# EAGLE design control_board (EAGLE 8.5.2)
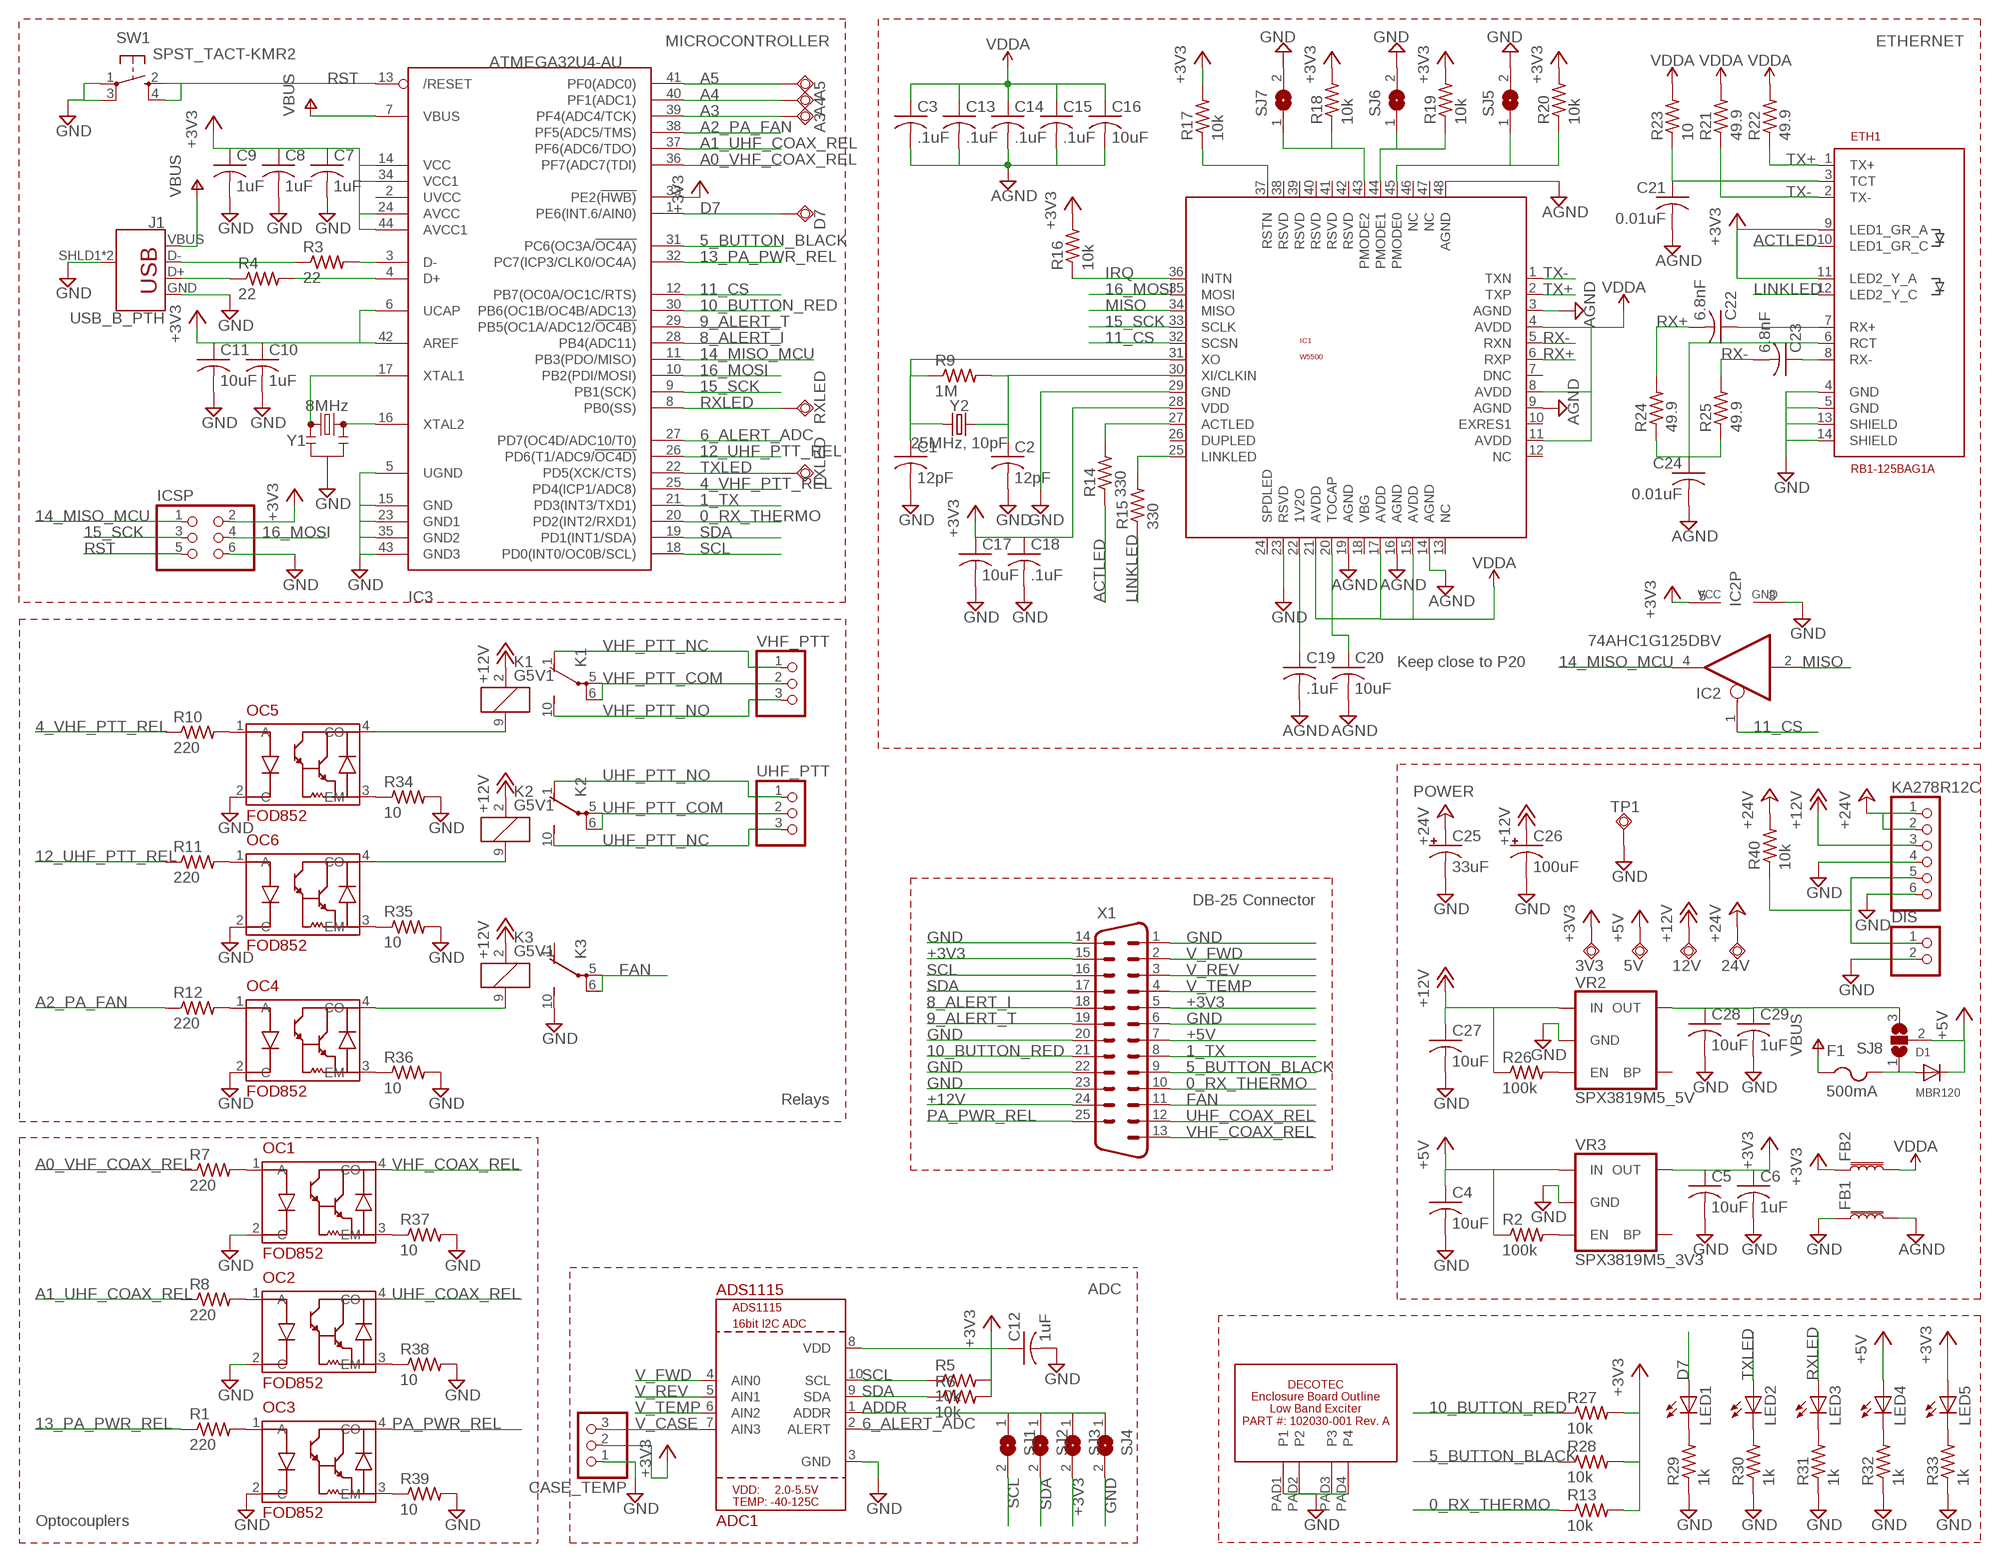
[diagram p0: schematic, sheet 1]

## Parts
3V3  TPSQTP20SQ  [TP20SQ]
5V  TPSQTP20SQ  [TP20SQ]
12V  TPSQTP20SQ  [TP20SQ]
24V  TPSQTP20SQ  [TP20SQ]
A3  TPSQTP20SQ  [TP20SQ]
A4  TPSQTP20SQ  [TP20SQ]
A5  TPSQTP20SQ  [TP20SQ]
ADC1  ADS1115  [MSOP10]
C1  12pF  C-USC0805K  [C0805K]
C2  12pF  C-USC0805K  [C0805K]
C3  .1uF  C-USC0805K  [C0805K]
C4  10uF  C-USC0805K  [C0805K]
C5  10uF  C-USC0805K  [C0805K]
C6  1uF  C-USC0805K  [C0805K]
C7  1uF  C-USC0805K  [C0805K]
C8  1uF  C-USC0805K  [C0805K]
C9  1uF  C-USC0805K  [C0805K]
C10  1uF  C-USC0805K  [C0805K]
C11  10uF  C-USC0805K  [C0805K]
C12  1uF  C-USC0805K  [C0805K]
C13  .1uF  C-USC0805K  [C0805K]
C14  .1uF  C-USC0805K  [C0805K]
C15  .1uF  C-USC0805K  [C0805K]
C16  10uF  C-USC0805K  [C0805K]
C17  10uF  C-USC0805K  [C0805K]
C18  .1uF  C-USC0805K  [C0805K]
C19  .1uF  C-USC0805K  [C0805K]
C20  10uF  C-USC0805K  [C0805K]
C21  0.01uF  C-USC0805K  [C0805K]
C22  6.8nF  C-USC0805K  [C0805K]
C23  6.8nF  C-USC0805K  [C0805K]
C24  0.01uF  C-USC0805K  [C0805K]
C25  33uF  CPOL-USC  [PANASONIC_C]
C26  100uF  CPOL-USD  [PANASONIC_D]
C27  10uF  C-USC0805K  [C0805K]
C28  10uF  C-USC0805K  [C0805K]
C29  1uF  C-USC0805K  [C0805K]
CASE_TEMP  PINHD-1X3  [1X03]
D1  MBR120  DIODESOD-123  [SOD-123]
D7  TPSQTP20SQ  [TP20SQ]
DIS  PINHD-1X2  [1X02]
ETH1  RB1-125BAG1A  [RB1-125BAG1A]
F1  500mA  PTCFUSE-1206  [R1206]
FB1  FERRITE_BEAD  [0805]
FB2  FERRITE_BEAD  [0805]
IC1  W5500  [LQFP48]
IC2  74AHC1G125DBV  [SOT23-5]
IC3  ATMEGA32U4-AU  [TQFP44]
ICSP  PINHD-2X3  [2X03]
J1  USB_B_PTH  [USB-B-PTH]
K1  G5V1  [G5V1]
K2  G5V1  [G5V1]
K3  G5V1  [G5V1]
KA278R12C  PINHD-1X6  [1X06]
LED1  LEDCHIPLED_0805  [CHIPLED_0805]
LED2  LEDCHIPLED_0805  [CHIPLED_0805]
LED3  LEDCHIPLED_0805  [CHIPLED_0805]
LED4  LEDCHIPLED_0805  [CHIPLED_0805]
LED5  LEDCHIPLED_0805  [CHIPLED_0805]
OC1  FOD852  [SMD4-7]
OC2  FOD852  [SMD4-7]
OC3  FOD852  [SMD4-7]
OC4  FOD852  [SMD4-7]
OC5  FOD852  [SMD4-7]
OC6  FOD852  [SMD4-7]
R1  220  R-US_R0805  [R0805]
R2  100k  R-US_R0805  [R0805]
R3  22  R-US_R0805  [R0805]
R4  22  R-US_R0805  [R0805]
R5  10k  R-US_R0805  [R0805]
R6  10k  R-US_R0805  [R0805]
R7  220  R-US_R0805  [R0805]
R8  220  R-US_R0805  [R0805]
R9  1M  R-US_R0805  [R0805]
R10  220  R-US_R0805  [R0805]
R11  220  R-US_R0805  [R0805]
R12  220  R-US_R0805  [R0805]
R13  10k  R-US_R0805  [R0805]
R14  330  R-US_R0805  [R0805]
R15  330  R-US_R0805  [R0805]
R16  10k  R-US_R0805  [R0805]
R17  10k  R-US_R0805  [R0805]
R18  10k  R-US_R0805  [R0805]
R19  10k  R-US_R0805  [R0805]
R20  10k  R-US_R0805  [R0805]
R21  49.9  R-US_R0805  [R0805]
R22  49.9  R-US_R0805  [R0805]
R23  10  R-US_R0805  [R0805]
R24  49.9  R-US_R0805  [R0805]
R25  49.9  R-US_R0805  [R0805]
R26  100k  R-US_R0805  [R0805]
R27  10k  R-US_R0805  [R0805]
R28  10k  R-US_R0805  [R0805]
R29  1k  R-US_R0805  [R0805]
R30  1k  R-US_R0805  [R0805]
R31  1k  R-US_R0805  [R0805]
R32  1k  R-US_R0805  [R0805]
R33  1k  R-US_R0805  [R0805]
R34  10  R-US_R0805  [R0805]
R35  10  R-US_R0805  [R0805]
R36  10  R-US_R0805  [R0805]
R37  10  R-US_R0805  [R0805]
R38  10  R-US_R0805  [R0805]
R39  10  R-US_R0805  [R0805]
R40  10k  R-US_R0805  [R0805]
RXLED  TPSQTP20SQ  [TP20SQ]
SJ1  SJ  [SJ]
SJ2  SJ  [SJ]
SJ3  SJ  [SJ]
SJ4  SJ  [SJ]
SJ5  SJ  [SJ]
SJ6  SJ  [SJ]
SJ7  SJ  [SJ]
SJ8  SJ2W  [SJ_2]
SW1  SPST_TACT-KMR2  [KMR2]
TP1  TPSQTP20SQ  [TP20SQ]
TXLED  TPSQTP20SQ  [TP20SQ]
U$3  DECOTEC_102030-001AV3  [DECOTEC_102030-001A_V3]
UHF_PTT  PINHD-1X3  [1X03]
VHF_PTT  PINHD-1X3  [1X03]
VR2  SPX3819M5_5V  V_REG_SPX3819-SOT23-5  [SOT23-5]
VR3  SPX3819M5_3V3  V_REG_SPX3819-SOT23-5  [SOT23-5]
X1  DB25_MALEVB  [M25VB]
Y1  8MHz  RESONATOR-8MHZSMD_3.2X1.3  [RESONATOR-SMD-3.2X1.3]
Y2  25MHz, 10pF  CRYSTALSMD-3.2X2.5  [CRYSTAL-SMD-3.2X2.5MM]

## Nets
0_RX_THERMO: IC3.20(PD2(INT2/RXD1)) R13.1 X1.10
1_TX: IC3.21(PD3(INT3/TXD1)) X1.8
4_VHF_PTT_REL: IC3.25(PD4(ICP1/ADC8)) R10.1
5_BUTTON_BLACK: IC3.31(PC6(OC3A/!OC4A)) R28.1 X1.9
6_ALERT_ADC: ADC1.2(ALERT) IC3.27(PD7(OC4D/ADC10/T0))
8_ALERT_I: IC3.28(PB4(ADC11)) X1.18
9_ALERT_T: IC3.29(PB5(OC1A/ADC12/!OC4B)) X1.19
10_BUTTON_RED: IC3.30(PB6(OC1B/OC4B/ADC13)) R27.1 X1.21
11_CS: IC1.32(SCSN) IC2.1(OE) IC3.12(PB7(OC0A/OC1C/RTS))
12_UHF_PTT_REL: IC3.26(PD6(T1/ADC9/!OC4D)) R11.1
13_PA_PWR_REL: IC3.32(PC7(ICP3/CLK0/OC4A)) R1.1
14_MISO_MCU: IC2.4(O) IC3.11(PB3(PDO/MISO)) ICSP.1
15_SCK: IC1.33(SCLK) IC3.9(PB1(SCK)) ICSP.3
16_MOSI: IC1.35(MOSI) IC3.10(PB2(PDI/MOSI)) ICSP.4
+3V3: 3V3.TP ADC1.8(VDD) C5.1 C6.1 C7.1 C8.1 C9.1 C10.1 C11.1 C12.1 C17.1 C18.1 CASE_TEMP.2 ETH1.9(LED1_GR_A) ETH1.11(LED2_Y_A) FB2.1 IC1.28(VDD) IC2.5(VCC) IC3.6(UCAP) IC3.14(VCC) IC3.24(AVCC) IC3.33(PE2(!HWB)) IC3.34(VCC1) IC3.42(AREF) IC3.44(AVCC1) ICSP.2 LED5.A R5.2 R6.2 R13.2 R16.2 R17.2 R18.2 R19.2 R20.2 R27.2 R28.2 SJ3.2 VR3.5(OUT) X1.5 X1.15
+5V: 5V.TP C4.1 D1.C LED4.A R2.1 SJ8.2 VR3.1(IN) X1.7
+12V: 12V.TP C26.+ C27.1 K1.2 K2.2 K3.2 KA278R12C.3 R26.1 VR2.1(IN) X1.24
+24V: 24V.TP C25.+ KA278R12C.1 KA278R12C.2 R40.2
A0_VHF_COAX_REL: IC3.36(PF7(ADC7(TDI)) R7.1
A1_UHF_COAX_REL: IC3.37(PF6(ADC6/TDO)) R8.1
A2_PA_FAN: IC3.38(PF5(ADC5/TMS)) R12.1
A3: A3.TP IC3.39(PF4(ADC4/TCK))
A4: A4.TP IC3.40(PF1(ADC1))
A5: A5.TP IC3.41(PF0(ADC0))
ACTLED: ETH1.10(LED1_GR_C) R14.1
ADDR: ADC1.1(ADDR) SJ1.1 SJ2.1 SJ3.1 SJ4.1
AGND: C3.2 C13.2 C14.2 C15.2 C16.2 C19.2 C20.2 C21.2 C24.2 FB1.2 IC1.3(AGND) IC1.9(AGND) IC1.14(AGND) IC1.16(AGND) IC1.19(AGND) IC1.48(AGND)
D7: D7.TP IC3.1(PE6(INT.6/AIN0)) LED1.A
FAN: K3.5(2:P) K3.6(2:P) X1.11
GND: ADC1.3(GND) C1.2 C2.2 C4.2 C5.2 C6.2 C7.2 C8.2 C9.2 C10.2 C11.2 C12.2 C17.2 C18.2 C25.- C26.- C27.2 C28.2 C29.2 CASE_TEMP.1 DIS.2 ETH1.4(GND) ETH1.5(GND) ETH1.13(SHIELD) ETH1.14(SHIELD) FB1.1 IC1.23(RSVD) IC1.29(GND) IC2.3(GND) IC3.5(UGND) IC3.15(GND) IC3.23(GND1) IC3.35(GND2) IC3.43(GND3) ICSP.6 J1.GND J1.SHLD1(SHIELD) J1.SHLD2(SHIELD) K3.10(2:S) KA278R12C.4 KA278R12C.6 OC1.2(C) OC2.2(C) OC3.2(C) OC4.2(C) OC5.2(C) OC6.2(C) R29.1 R30.1 R31.1 R32.1 R33.1 R34.2 R35.2 R36.2 R37.2 R38.2 R39.2 SJ4.2 SJ5.2 SJ6.2 SJ7.2 SW1.1(P) SW1.3(P1) TP1.TP U$3.PAD1(P1) U$3.PAD2(P2) U$3.PAD3(P3) U$3.PAD4(P4) VR2.2(GND) VR3.2(GND) X1.1 X1.6 X1.14 X1.20 X1.22 X1.23 Y1.2
IRQ: IC1.36(INTN) R16.1
LINKLED: ETH1.12(LED2_Y_C) R15.1
MISO: IC1.34(MISO) IC2.2(I)
N$1: OC3.1(A) R1.2
N$2: K3.9 OC4.4(CO)
N$3: R2.2 VR3.3(EN)
N$4: IC3.17(XTAL1) Y1.1
N$5: IC3.16(XTAL2) Y1.3
N$6: C1.1 IC1.31(XO) R9.1 Y2.1
N$7: C2.1 IC1.30(XI/CLKIN) R9.2 Y2.3
N$8: J1.D- R3.1
N$9: IC3.3(D-) R3.2
N$10: IC3.4(D+) R4.2
N$11: J1.D+ R4.1
N$12: OC1.1(A) R7.2
N$13: OC2.1(A) R8.2
N$14: IC1.37(RSTN) R17.1
N$15: OC5.1(A) R10.2
N$16: LED1.C R29.2
N$17: LED2.C R30.2
N$18: LED4.C R32.2
N$19: LED5.C R33.2
N$20: OC6.1(A) R11.2
N$21: OC4.1(A) R12.2
N$22: K1.9 OC5.4(CO)
N$23: K2.9 OC6.4(CO)
N$24: LED3.C R31.2
N$25: OC5.3(EM) R34.1
N$26: OC6.3(EM) R35.1
N$27: OC4.3(EM) R36.1
N$28: OC1.3(EM) R37.1
N$29: IC1.27(ACTLED) R14.2
N$30: IC1.25(LINKLED) R15.2
N$31: C28.1 C29.1 SJ8.3 VR2.5(OUT)
N$32: OC2.3(EM) R38.1
N$33: C20.1 IC1.20(TOCAP)
N$34: C19.1 IC1.22(1V2O)
N$35: C23.1 ETH1.8(RX-)
N$36: C22.1 ETH1.7(RX+)
N$37: C24.1 ETH1.6(RCT) R24.1 R25.1
N$38: R26.2 VR2.3(EN)
N$39: D1.A F1.2 SJ8.1
N$40: OC3.3(EM) R39.1
N$41: DIS.1 KA278R12C.5 R40.1
PA_PWR_REL: OC3.4(CO) X1.25
PMODE0: IC1.45(PMODE0) R20.1 SJ5.1
PMODE1: IC1.44(PMODE1) R19.1 SJ6.1
PMODE2: IC1.43(PMODE2) R18.1 SJ7.1
RST: IC3.13(/RESET) ICSP.5 SW1.2(S) SW1.4(S1)
RX+: C22.2 IC1.6(RXP) R24.2
RX-: C23.2 IC1.5(RXN) R25.2
RXLED: IC3.8(PB0(SS)) LED3.A RXLED.TP
SCL: ADC1.10(SCL) IC3.18(PD0(INT0/OC0B/SCL)) R5.1 SJ1.2 X1.16
SDA: ADC1.9(SDA) IC3.19(PD1(INT1/SDA)) R6.1 SJ2.2 X1.17
TCT: C21.1 ETH1.3(TCT) R23.1
TX+: ETH1.1(TX+) IC1.2(TXP) R22.1
TX-: ETH1.2(TX-) IC1.1(TXN) R21.1
TXLED: IC3.22(PD5(XCK/CTS)) LED2.A TXLED.TP
UHF_COAX_REL: OC2.4(CO) X1.12
UHF_PTT_COM: K2.5(2:P) K2.6(2:P) UHF_PTT.2
UHF_PTT_NC: K2.10(2:S) UHF_PTT.3
UHF_PTT_NO: K2.1(2:O) UHF_PTT.1
V_CASE: ADC1.7(AIN3) CASE_TEMP.3
V_FWD: ADC1.4(AIN0) X1.2
V_REV: ADC1.5(AIN1) X1.3
V_TEMP: ADC1.6(AIN2) X1.4
VBUS: F1.1 IC3.7(VBUS) J1.VBUS
VDDA: C3.1 C13.1 C14.1 C15.1 C16.1 FB2.2 IC1.4(AVDD) IC1.8(AVDD) IC1.11(AVDD) IC1.15(AVDD) IC1.17(AVDD) IC1.21(AVDD) R21.2 R22.2 R23.2
VHF_COAX_REL: OC1.4(CO) X1.13
VHF_PTT_COM: K1.5(2:P) K1.6(2:P) VHF_PTT.2
VHF_PTT_NC: K1.1(2:O) VHF_PTT.1
VHF_PTT_NO: K1.10(2:S) VHF_PTT.3
Unconnected: IC1.7(DNC) IC1.10(EXRES1) IC1.12(NC) IC1.13(NC) IC1.18(VBG) IC1.24(SPDLED) IC1.26(DUPLED) IC1.38(RSVD) IC1.39(RSVD) IC1.40(RSVD) IC1.41(RSVD) IC1.42(RSVD) IC1.46(NC) IC1.47(NC) IC3.2(UVCC) K3.1(2:O) VR2.4(BP) VR3.4(BP)

## Notes on the sheet
- MICROCONTROLLER | ETHERNET
- Keep close to P20
- POWER
- DB-25 Connector
- Relays
- ADC
- Optocouplers

## Library data of the parts
3V3 5V 12V 24V TP1 = testpad:TPSQ: Test pad
A3-A5 D7 RXLED TXLED = testpad:TPSQ: Test pad; SPICEPREFIX: X
ADC1 = vtgs:ADS1115
C1-C24 C27-C29 = rcl:C-US: CAPACITOR, American symbol; SPICEPREFIX: C
C25 C26 = rcl:CPOL-US: POLARIZED CAPACITOR, American symbol; SPICEPREFIX: C
CASE_TEMP UHF_PTT VHF_PTT = pinhead:PINHD-1X3: PIN HEADER
D1 = adafruit:DIODE: Diode SMADIODE - SMA Surface Mount Package 20V 1A Schottky Diode Digikey: 641-1014-6-ND DO-1N4148 - Through Hole Small Current Diode SOD-123 20V 1 A (.5mV Vf) Schottky Diode - Digikey: MBRX120TPMSCT-ND SOD-323 10V 570mA (.38mV Vf, 3ns) Schottky Diode - Digikey: ZLLS410CT-ND SOD-523 30V 30mA Schottky Diode (RB751S-40TE61) - Digikey: RB751S-40TE61CT-ND SOT23-R/W - SOT23 Package (R = Solder Paste/Reflow Ovens, W = Hand-Soldering) BAT54Film 40V 300mA - Digikey: 497-7162-1-ND
DIS = pinhead:PINHD-1X2: PIN HEADER
ETH1 = vtgs:RB1-125BAG1A
F1 = adafruit:PTCFUSE: PTC fuses, resettable thermistors
FB1 FB2 = vtgs:FERRITE_BEAD
IC1 = vtgs:W5500
IC2 = 74xx-little-us:74*1G125: Single Bus Buffer Gate with 3-State Output
IC3 = adafruit:ATMEGA32U4: http://www.ladyada.net/library/eagle; SPICEPREFIX: X
ICSP = pinhead:PINHD-2X3: PIN HEADER; SPICEPREFIX: X
J1 = SparkFun-Connectors:USB_B: USB Type B Connector SparkFun Products: SparkFun Stepoko <https://www.sparkfun.com/products/13899> PTH; PROD_ID: CONN-08278; SF_ID: PRT-00139; SPICEPREFIX: X
K1-K3 = relay:G5V1: RELAY 1 x switch, 0.5 A/125 V AC, 1 A/24 V DC , Omron; MPN: G5V-1-DC24; OC_FARNELL: 9949593; OC_NEWARK: 36M6377
KA278R12C = pinhead:PINHD-1X6: PIN HEADER
LED1-LED5 = adafruit:LED: LED OSRAM: - CHIPLED LG R971, LG N971, LY N971, LG Q971, LY Q971, LO R971, LY R971 LH N974, LH R974 LS Q976, LO Q976, LY Q976 LO Q996 - Hyper CHIPLED LW Q18S LB Q993, LB Q99A, LB R99A - SideLED LS A670, LO A670, LY A670, LG A670, LP A670 LB A673, LV A673, LT A673, LW A673 LH A674 LY A675 LS A676, LA A676, LO A676, LY A676, LW A676 LS A679, LY A679, LG A679 - Hyper Micro SIDELED® LS Y876, LA Y876, LO Y876, LY Y876 LT Y87S - SmartLED LW L88C, LW L88S LB L89C, LB L89S, LG L890 LS L89K, LO L89K, LY L89K LS L896, LA L896, LO L896, LY L896 - TOPLED LS T670, LO T670, LY T670, LG T670, LP T670 LSG T670, LSP T670, LSY T670, LOP T670, LYG T670 LG T671, LOG T671, LSG T671 LB T673, LV T673, LT T673, LW T673 LH T674 LS T676, LA T676, LO T676, LY T676, LB T676, LH T676, LSB T676, LW T676 LB T67C, LV T67C, LT T67C, LS T67K, LO T67K, LY T67K, LW E67C LS E67B, LA E67B, LO E67B, LY E67B, LB E67C, LV E67C, LT E67C LW T67C LS T679, LY T679, LG T679 LS T770, LO T770, LY T770, LG T770, LP T770 LB T773, LV T773, LT T773, LW T773 LH T774 LS E675, LA E675, LY E675, LS T675 LS T776, LA T776, LO T776, LY T776, LB T776 LHGB T686 LT T68C, LB T68C - Hyper Mini TOPLED® LB M676 - Mini TOPLED Santana® LG M470 LS M47K, LO M47K, LY M47K Source: http://www.osram.convergy.de/
OC1-OC6 = vtgs:FOD852
R1-R40 = rcl:R-US_: RESISTOR, American symbol; SPICEPREFIX: R
SJ1-SJ7 = jumper:SJ: SMD solder JUMPER
SJ8 = jumper:SJ2W: SMD solder JUMPER
SW1 = adafruit:SPST_TACT: SMT 6mm switch, EVQQ2 series http://www.ladyada.net/library/eagle; SPICEPREFIX: S
U$3 = vtgs:DECOTEC_102030-001A
VR2 VR3 = kj4qlp:V_REG_SPX3819: SPX3819 Voltage Regulator 3.3V 500mA, 16V input Datasheet <https://www.exar.com/content/document.ashx?id=22106> SparkFun Products: SparkFun Serial Controlled Motor Driver <https://www.sparkfun.com/products/13911>; PROD_ID: VREG-13321; VALUE: SPX3819M5_X_X
X1 = SparkFun-Retired:DB25_MALE: Various DB25 connectors
Y1 = SparkFun-Clocks:RESONATOR-8MHZ: 8MHz Resonator Digikey Example <http://www.digikey.com/product-detail/en/murata-electronics-north-america/CSTCE10M0G55-R0/490-1196-1-ND/584633> Frequency: 8MHz Frequency Stability: ±0.2% Frequency Tolerance: ±0.5% Capacitance: 33pF SparkFun Products Arduino Pro Mini 328- 3.3V/8MHz <https://www.sparkfun.com/products/11114> SparkFun Digital Sandbox <https://www.sparkfun.com/products/12651>; PROD_ID: XTAL-08895; SPICEPREFIX: J
Y2 = SparkFun-Clocks:CRYSTAL: Crystals (Generic) These are passive quartz crystals, which can be used as a clock source for a microcontroller. Crystal's are two-terminal devices. They require external "load" capacitors to generate an oscillating signal.

## Board
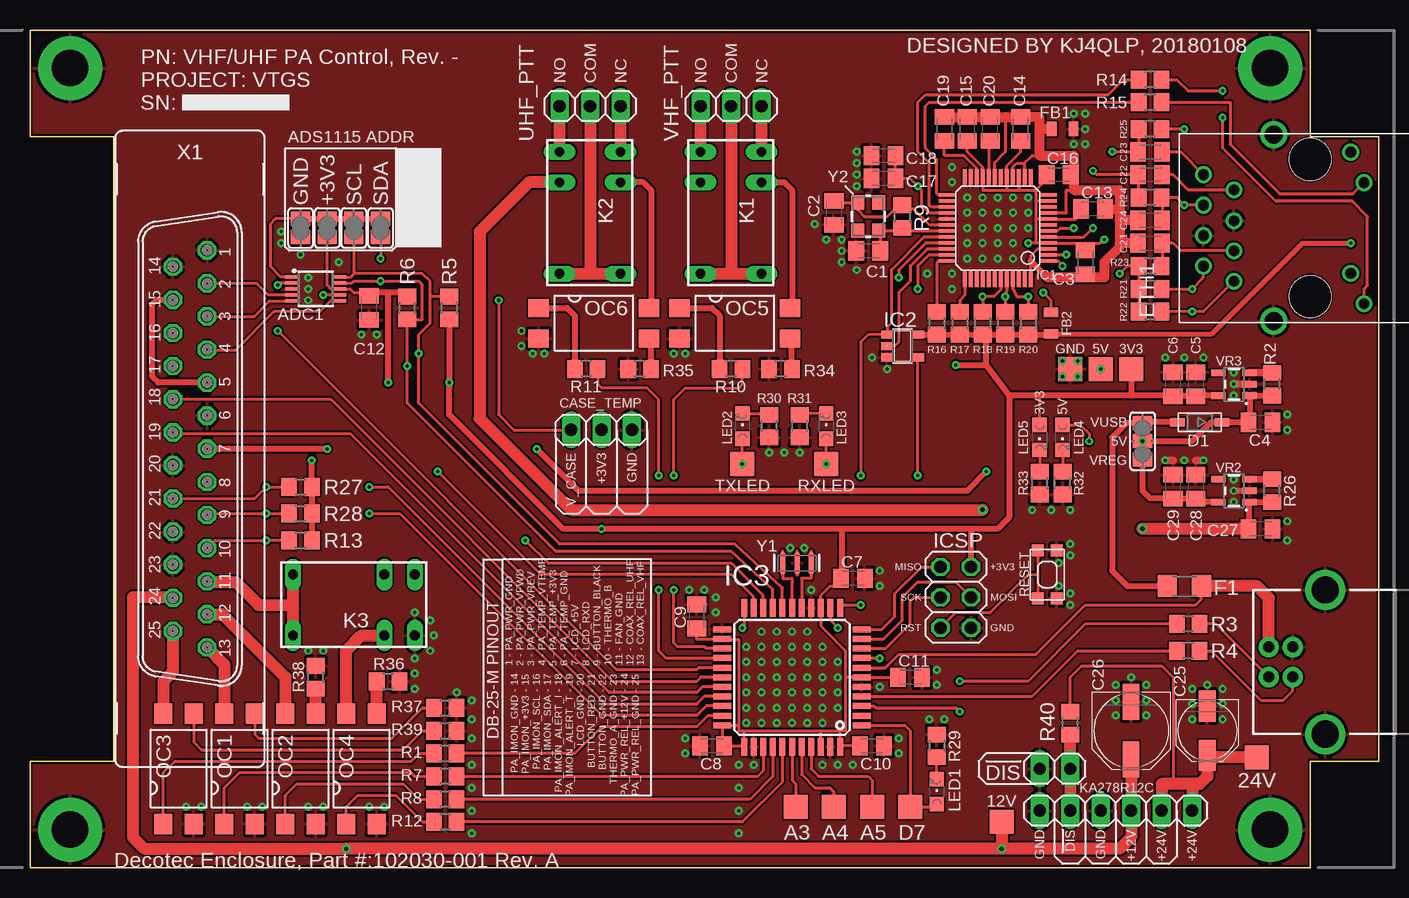
[diagram p1: board, top side]
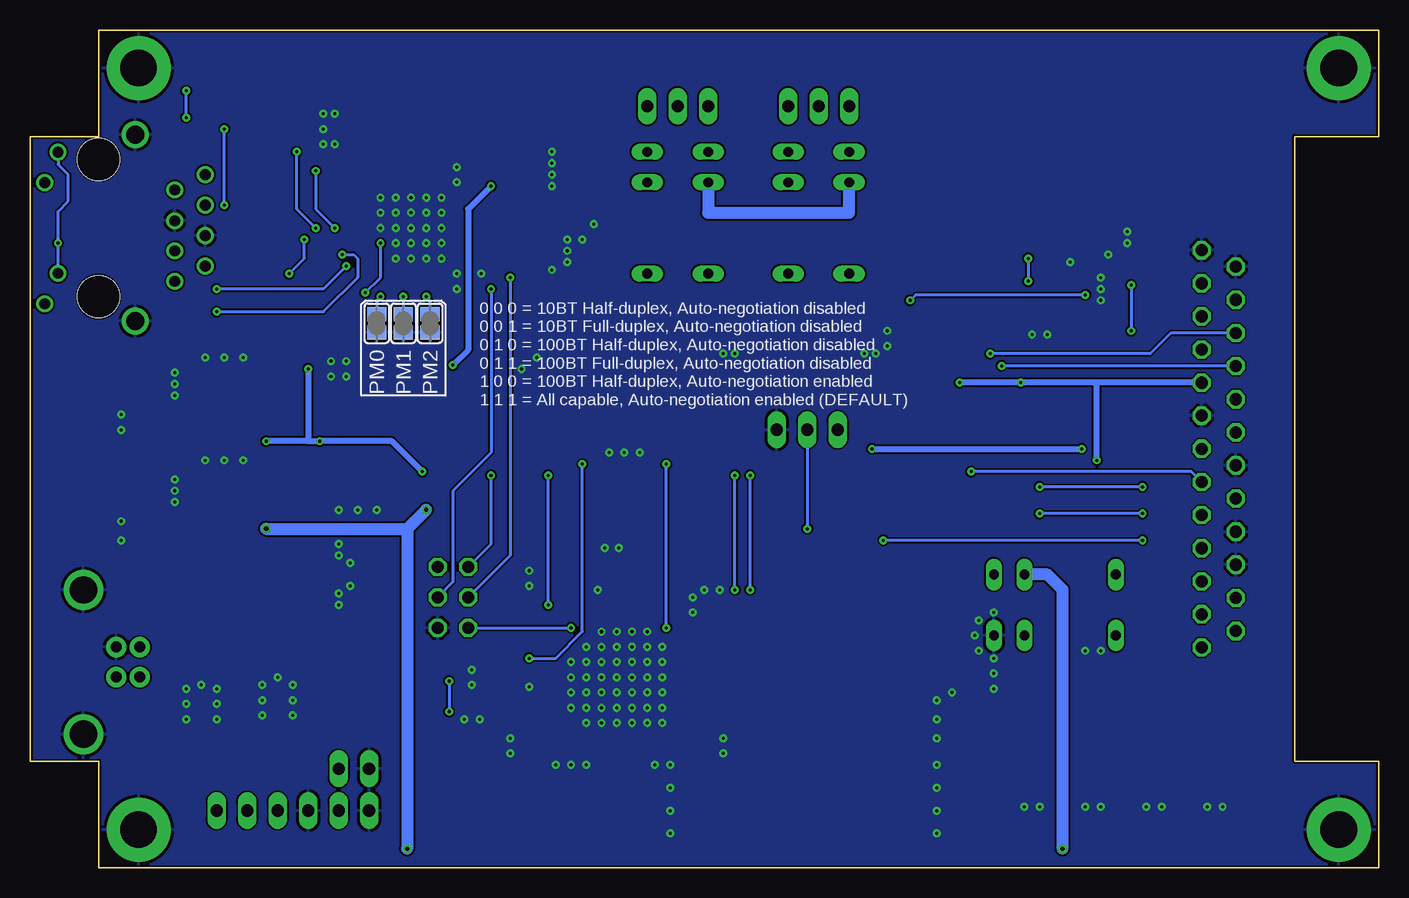
[diagram p2: board, bottom side, seen from below]

Size 112.39 x 69.85 mm. Coordinates in mm from the lower left corner, seen from the top.
Copper layers (1*16): Top 0.035mm / dielectric 1.5mm / Bottom 0.035mm
Design rules "default *": minimum track width 6mil, minimum drill 10mil, track to track 6mil, track to pad 6mil, pad to pad 6mil, via to via 6mil, smd to smd 6mil, copper to edge 6mil, drill to drill 6mil, minimum pad ring 10mil, minimum via ring 8mil, stop-mask expansion 4mil, vias tented up to drill 0mil, thermal gap 10mil

### Footprints (pad centres in the part's own frame; a part is rotated, then mirrored left to right if it is on the bottom)
TP20SQ = smd 2 x 2: TP 0,0
MSOP10 = smd 0.3 x 1: 1 -1,-2.05; 2 -0.5,-2.05; 3 0,-2.05; 4 0.5,-2.05; 5 1,-2.05; 6 1,2.05; 7 0.5,2.05; 8 0,2.05; 9 -0.5,2.05; 10 -1,2.05
C0805K = smd 1.3 x 1.6: 1 -1,0; 2 1,0
PANASONIC_C = smd 2.6 x 1.4: + 2.05,0; - -2.05,0
PANASONIC_D = smd 3 x 1.4: + 2.4,0; - -2.4,0
1X03 = drill 1.016 long: 1 -2.54,0; 2 0,0; 3 2.54,0
SOD-123 = smd 1.2 x 0.7: A 1.85,0; C -1.85,0
1X02 = drill 1.016 long: 1 -1.27,0; 2 1.27,0
RB1-125BAG1A = drill 0.9: 1 -4.445,6.35; 2 -3.175,8.89; 3 -1.905,6.35; 4 -0.635,8.89; 5 0.595,6.35; 6 1.905,8.89; 7 3.175,6.35; 8 4.45,8.89; 9 -3.785,-3.38; 10 -6.325,-4.49; 11 6.325,-3.38; 12 3.785,-4.49 | drill 1.5: 13 -7.775,3.05; 14 7.775,3.05 | hole 3.5: -5.715,0; 5.715,0
R1206 = smd 1.6 x 1.803: 1 -1.422,0; 2 1.422,0
0805 = smd 0.8 x 1.2: 1 -0.9,0; 2 0.9,0
LQFP48 = smd 1.35 x 0.3: 1 -4.25,2.75; 2 -4.25,2.25; 3 -4.25,1.75; 4 -4.25,1.25; 5 -4.25,0.75; 6 -4.25,0.25; 7 -4.25,-0.25; 8 -4.25,-0.75; 9 -4.25,-1.25; 10 -4.25,-1.75; 11 -4.25,-2.25; 12 -4.25,-2.75; 25 4.25,-2.75; 26 4.25,-2.25; 27 4.25,-1.75; 28 4.25,-1.25; 29 4.25,-0.75; 30 4.25,-0.25; 31 4.25,0.25; 32 4.25,0.75; 33 4.25,1.25; 34 4.25,1.75; 35 4.25,2.25; 36 4.25,2.75 | smd 0.3 x 1.35: 13 -2.75,-4.25; 14 -2.25,-4.25; 15 -1.75,-4.25; 16 -1.25,-4.25; 17 -0.75,-4.25; 18 -0.25,-4.25; 19 0.25,-4.25; 20 0.75,-4.25; 21 1.25,-4.25; 22 1.75,-4.25; 23 2.25,-4.25; 24 2.75,-4.25; 37 2.75,4.25; 38 2.25,4.25; 39 1.75,4.25; 40 1.25,4.25; 41 0.75,4.25; 42 0.25,4.25; 43 -0.25,4.25; 44 -0.75,4.25; 45 -1.25,4.25; 46 -1.75,4.25; 47 -2.25,4.25; 48 -2.75,4.25
SOT23-5 = smd 0.69 x 0.99: 1 -0.95,-1.29; 2 0,-1.29; 3 0.95,-1.29; 4 0.95,1.3; 5 -0.95,1.3
TQFP44 = smd 1.5 x 0.5: 1 -5.8,4; 2 -5.8,3.2; 3 -5.8,2.4; 4 -5.8,1.6; 5 -5.8,0.8; 6 -5.8,0; 7 -5.8,-0.8; 8 -5.8,-1.6; 9 -5.8,-2.4; 10 -5.8,-3.2; 11 -5.8,-4; 23 5.8,-4; 24 5.8,-3.2; 25 5.8,-2.4; 26 5.8,-1.6; 27 5.8,-0.8; 28 5.8,0; 29 5.8,0.8; 30 5.8,1.6; 31 5.8,2.4; 32 5.8,3.2; 33 5.8,4 | smd 0.5 x 1.5: 12 -4,-5.8; 13 -3.2,-5.8; 14 -2.4,-5.8; 15 -1.6,-5.8; 16 -0.8,-5.8; 17 0,-5.8; 18 0.8,-5.8; 19 1.6,-5.8; 20 2.4,-5.8; 21 3.2,-5.8; 22 4,-5.8; 34 4,5.8; 35 3.2,5.8; 36 2.4,5.8; 37 1.6,5.8; 38 0.8,5.8; 39 0,5.8; 40 -0.8,5.8; 41 -1.6,5.8; 42 -2.4,5.8; 43 -3.2,5.8; 44 -4,5.8
2X03 = drill 1.016 octagon: 1 -2.54,-1.27; 2 -2.54,1.27; 3 0,-1.27; 4 0,1.27; 5 2.54,-1.27; 6 2.54,1.27
USB-B-PTH = drill 0.914 pad 1.676: D+ 4,1.25; D- 5.981,1.25; GND 4,-1.25; VBUS 5.981,-1.25 | drill 2.286: SHLD1 1.282,-6.02; SHLD2 1.282,6.02
G5V1 = drill 0.813 long: 1 -5.08,-2.54; 2 -2.54,-2.54; 5 5.08,-2.54; 6 5.08,2.54; 9 -2.54,2.54; 10 -5.08,2.54
1X06 = drill 1.016 long: 1 -6.35,0; 2 -3.81,0; 3 -1.27,0; 4 1.27,0; 5 3.81,0; 6 6.35,0
CHIPLED_0805 = smd 1.2 x 1.2: A 0,-1.05; C 0,1.05
SMD4-7 = smd 1.7 x 1.5: 1 -4.6,1.27; 2 -4.6,-1.27; 3 4.6,-1.27; 4 4.6,1.27
R0805 = smd 1.3 x 1.5: 1 -0.95,0; 2 0.95,0
SJ = smd 1.168 x 1.6: 1 -0.762,0; 2 0.762,0
SJ_2 = smd 1.168 x 1.6: 1 -1.524,0; 2 0,0; 3 1.524,0
KMR2 = smd 1 x 1: 1 2,0.8; 2 2,-0.8; 3 -2,0.8; 4 -2,-0.8
DECOTEC_102030-001A_V3 = drill 3.048 pad 5.334: PAD1 10.319,3.175; PAD2 10.319,66.675; PAD3 110.331,66.675; PAD4 110.331,3.175
SOT23-5' = smd 0.55 x 1.2: 1 -0.95,-1.3; 2 0,-1.3; 3 0.95,-1.3; 4 0.95,1.3; 5 -0.95,1.3
M25VB = drill 1.016 octagon: 1 16.561,-1.422; 2 13.792,-1.422; 3 11.049,-1.422; 4 8.28,-1.422; 5 5.512,-1.422; 6 2.769,-1.422; 7 0,-1.422; 8 -2.769,-1.422; 9 -5.512,-1.422; 10 -8.28,-1.422; 11 -11.049,-1.422; 12 -13.792,-1.422; 13 -16.561,-1.422; 14 15.189,1.422; 15 12.421,1.422; 16 9.652,1.422; 17 6.909,1.422; 18 4.14,1.422; 19 1.372,1.422; 20 -1.372,1.422; 21 -4.14,1.422; 22 -6.909,1.422; 23 -9.652,1.422; 24 -12.421,1.422; 25 -15.189,1.422
RESONATOR-SMD-3.2X1.3 = smd 0.45 x 1.905: 1 -1.2,0; 2 0,0; 3 1.2,0
CRYSTAL-SMD-3.2X2.5MM = smd 1.2 x 1.1: 1 -1.175,-0.875; 2 1.175,-0.875; 3 1.175,0.875; 4 -1.175,0.875

### Placement (x,y rotation side)
3V3  91.76,41.59 0 top
5V  89.22,41.59 0 top
12V  80.96,3.81 0 top
24V  102.23,9.21 270 top
A3  63.82,5.08 0 top
A4  66.99,5.08 0 top
A5  70.17,5.08 0 top
ADC1  23.81,48.26 270 top
C1  69.85,51.44 180 top
C2  66.99,54.61 270 top
C3  87.95,50.48 270 top
C4  102.55,37.15 0 top
C5  97.16,40.32 90 top
C6  95.25,40.32 90 top
C7  68.58,24.13 0 top
C8  56.83,10.16 180 top
C9  55.56,20.95 90 top
C10  70.17,10.16 0 top
C11  73.34,15.88 0 top
C12  28.26,46.67 270 top
C13  88.58,54.93 0 top
C14  82.55,61.59 90 top
C15  78.11,61.59 90 top
C16  85.72,57.78 0 top
C17  71.12,57.47 180 top
C18  71.12,59.37 180 top
C19  76.2,61.59 90 top
C20  80.01,61.59 90 top
C21  93.34,52.07 180 top
C22  93.34,57.78 180 top
C23  93.34,59.69 180 top
C24  93.34,53.98 180 top
C25  98.11,11.43 270 top
C26  91.76,11.43 270 top
C27  102.55,28.26 0 top
C28  97.16,31.75 90 top
C29  95.25,31.75 90 top
CASE_TEMP  47.62,36.51 180 top
D1  97.47,37.15 180 top
D7  73.34,5.08 0 top
DIS  85.41,8.26 180 top
ETH1  106.68,53.34 90 top
F1  96.2,23.5 180 top
FB1  86.04,61.59 180 top
FB2  85.09,45.4 90 top
IC1  80.64,53.34 180 top
IC2  72.71,43.5 270 top
IC3  63.5,15.88 180 top
ICSP  77.15,22.54 270 top
J1  109.22,17.14 180 top
K1  58.42,54.61 270 top
K2  46.67,54.61 270 top
K3  26.99,21.91 180 top
KA278R12C  90.49,4.76 180 top
LED1  75.56,6.35 0 top
LED2  59.37,36.83 0 top
LED3  66.36,36.83 0 top
LED4  86.04,35.88 180 top
LED5  84.14,35.88 180 top
OC1  17.46,8.26 90 top
OC2  22.54,8.26 90 top
OC3  12.38,8.26 90 top
OC4  27.62,8.26 90 top
OC5  58.74,45.4 0 top
OC6  46.99,45.4 0 top
R1  34.61,9.53 180 top
R2  103.5,40.32 90 top
R3  96.52,20.32 180 top
R4  96.52,18.1 180 top
R5  34.92,46.67 270 top
R6  31.43,46.67 90 top
R7  34.61,7.62 180 top
R8  34.61,5.71 180 top
R9  72.71,54.29 90 top
R10  58.42,41.59 180 top
R11  46.35,41.59 180 top
R12  34.61,3.81 180 top
R13  22.54,27.3 0 top
R14  93.34,65.72 180 top
R15  93.34,63.82 180 top
R16  75.56,45.4 270 top
R17  77.47,45.4 270 top
R18  79.38,45.4 270 top
R19  81.28,45.4 270 top
R20  83.19,45.4 270 top
R21  93.34,48.26 180 top
R22  93.34,46.35 180 top
R23  93.34,50.16 180 top
R24  93.34,55.88 180 top
R25  93.34,61.59 180 top
R26  103.5,31.43 90 top
R27  22.54,31.75 0 top
R28  22.54,29.53 0 top
R29  75.56,10.16 270 top
R30  61.59,36.83 90 top
R31  64.14,36.83 90 top
R32  86.04,32.07 90 top
R33  84.14,32.07 90 top
R34  62.55,41.59 180 top
R35  50.8,41.59 180 top
R36  29.84,15.56 0 top
R37  34.61,13.34 0 top
R38  23.81,15.88 90 top
R39  34.61,11.43 0 top
R40  86.68,12.06 90 top
RXLED  66.36,33.66 0 top
SJ1  26.99,53.34 270 top
SJ2  29.21,53.34 270 top
SJ3  24.77,53.34 270 top
SJ4  22.54,53.34 270 top
SJ5  83.5,45.4 270 bottom
SJ6  81.28,45.4 270 bottom
SJ7  79.06,45.4 270 bottom
SJ8  92.71,35.56 270 top
SW1  84.77,24.45 270 top
TP1  86.68,41.59 0 top
TXLED  59.37,33.66 0 top
U$3  -6.99,0 0 top
UHF_PTT  46.67,63.5 0 top
VHF_PTT  58.42,63.5 0 top
VR2  SPX3819M5_5V  [SOT23-5']  100.33,31.43 90 top
VR3  SPX3819M5_3V3  [SOT23-5']  100.33,40.32 90 top
X1  13.34,34.92 90 top
Y1  63.92,25.4 0 top
Y2  69.85,54.29 90 top

### Tracks (layer width: path | path; a pad name or v marks a point on that pad's centre or on a via)
0_RX_THERMO  (via drill 0.25)
  Top 0.254: R13.1 v19.68,27.3 15.42,27.3 X1.10 | v41.27,27.3 43.18,25.4 58.42,25.4 61.1,22.72 IC3.20
  Bottom 0.254: v19.68,27.3 v41.27,27.3
1_TX  (via drill 0.25)
  Top 0.254: IC3.21 60.3,22.57 58.42,24.45 42.55,24.45 v33.97,33.02
  Bottom 0.254: X1.8 15.62,33.02 v33.97,33.02
4_VHF_PTT_REL  (via drill 0.25)
  Top 0.254: IC3.25 56.38,18.27 56.2,18.41 53.98,18.41 53.66,18.73 v53.66,23.18 | v53.66,32.7 53.66,39.05 54.61,40.01 59.05,40.01 59.37,40.32 R10.1
  Bottom 0.254: v53.66,23.18 v53.66,32.7
5_BUTTON_BLACK  (via drill 0.25)
  Top 0.254: IC3.31 56.34,13.47 55.56,12.7 47.62,12.7 30.8,29.53 v28.26,29.53 | R28.1 v19.68,29.53 14.87,29.53 X1.9
  Bottom 0.254: v19.68,29.53 v28.26,29.53
6_ALERT_ADC  (via drill 0.25)
  Top 0.254: ADC1.2 20.77,48.76 v20.64,48.58 | IC3.27 55.73,16.68 55.56,16.51 48.9,16.51 v20.64,44.77
  Bottom 0.254: v20.64,48.58 v20.64,44.77
8_ALERT_I
  Top 0.254: X1.18 25.07,39.06 48.58,15.56 55.56,15.56 55.88,15.88 IC3.28
9_ALERT_T
  Top 0.254: X1.19 12.01,36.2 26.67,36.2 48.26,14.61 55.56,14.61 56.03,15.07 IC3.29
10_BUTTON_RED  (via drill 0.25)
  Top 0.254: IC3.30 56.19,14.28 55.56,13.65 47.94,13.65 29.84,31.75 v28.26,31.75 | R27.1 v19.68,31.75 18.72,30.79 X1.21
  Bottom 0.254: v19.68,31.75 v28.26,31.75
11_CS  (via drill 0.25)
  Top 0.254: IC3.12 67.73,21.91 v69.22,21.91 | v69.22,32.7 69.22,43.81 69.85,44.45 IC2.1 71.44,44.45 71.44,45.09 71.75,45.4 71.75,49.85 74.5,52.59 IC1.32
  Bottom 0.254: v69.22,21.91 v69.22,32.7
12_UHF_PTT_REL  (via drill 0.25)
  Top 0.254: IC3.26 57.69,17.46 53.02,17.46 52.39,18.1 v52.39,23.18 | v52.39,32.7 52.39,39.05 51.44,40.01 47.62,40.01 47.31,40.32 R11.1
  Bottom 0.254: v52.39,23.18 v52.39,32.7
13_PA_PWR_REL
  Top 0.254: IC3.32 56.49,12.68 55.56,11.75 47.62,11.75 45.4,9.53 R1.1
14_MISO_MCU  (via drill 0.25)
  Top 0.254: ICSP.1 74.3,25.08 72.07,22.86 72.07,20.95 70.99,19.88 IC3.11 | v73.98,32.7 73.98,42.2 IC2.4
  Bottom 0.254: ICSP.1 73.98,26.99 v73.98,32.7
15_SCK  (via drill 0.25)
  Top 0.254: IC1.33 74.63,52.09 72.39,49.85 v72.39,49.21 | IC3.9 71.3,18.27 73.34,20.32 73.34,22.23 73.66,22.54 ICSP.3
  Bottom 0.254: v72.39,49.21 72.39,26.04 ICSP.3
16_MOSI  (via drill 0.25)
  Top 0.254: IC1.35 74.9,51.09 73.98,50.16 v73.98,48.26 | IC3.10 71.14,19.07 72.71,20.64 72.71,22.54 73.98,23.81 77.15,23.81 ICSP.4
  Bottom 0.254: v73.98,48.26 73.98,34.61 77.15,31.43 77.15,23.81 ICSP.4
+3V3  (via drill 0.25)
  Top 0.254: 76.42,54.61 IC1.28 74.95,54.59 74.3,55.24 74.3,56.52 v73.98,56.83 73.34,57.47 C17.1 C18.1 | IC2.5 73.98,44.42 | C11.1 IC3.6 67.94,15.88 | IC3.44 67.5,10.16 | 67.5,10.16 67.5,11.43 | IC3.42 65.9,11.43 | 65.9,11.43 67.5,11.43 | 67.5,11.43 67.94,11.43 67.94,15.88 | 67.94,15.88 67.94,18.1 66.36,19.68 65.9,20.18 IC3.14 65.9,22.72 66.67,23.5 67.58,23.5 C7.1 | IC3.34 59.37,10.21 | IC3.33 57.78,11.79 | C9.1 55.56,19.05 57.67,19.05 IC3.24 57.73,19.05 59.05,19.05 59.05,11.75 | C12.1 28.26,47.94 26.99,47.94 26.67,48.26 ADC1.8 25.08,48.26 24.77,48.58 SJ3.2 | IC3.33 57.7,10.29 C8.1 59.41,10.16 IC3.34 | C10.1 67.5,10.16 | 14.92,40.32 14.81,40.44 X1.5 | 59.05,11.75 59.05,11.43 59.37,11.43 | 59.37,11.43 65.9,11.43 | IC3.33 58.93,11.88 59.05,11.75 | IC3.34 59.5,11.3 59.37,11.43 | LED5.A 84.14,39.37
  Top 0.406: FB2.1 98.48,44.5 106.05,52.07 v110.06,52.07
  Top 0.508: 79.69,44.45 R18.2 R17.2 R16.2 IC2.5 | 79.69,44.45 R19.2 R20.2 85.04,44.45 FB2.1 | VR3.5 97.2,39.37 C5.1 C6.1 94.89,39.37 91.76,39.37 | 81.6,39.37 79.69,41.91 | 79.69,41.91 79.69,44.45 | v77.15,41.91 79.69,41.91 | 91.76,39.37 84.14,39.37 81.6,39.37 | 81.6,39.37 81.6,29.21 80.64,28.26 78.42,28.26 | C12.1 28.57,47.94 29.84,47.94 | R13.2 R28.2 R27.2 23.49,33.34 v23.5,33.97 | R6.2 31.43,47.94 29.84,47.94 | v29.84,40.44 29.84,47.94 | X1.5 10.68,40.44 10.16,40.96 10.16,46.99 10.52,47.35 X1.15 | R5.2 v34.92,40.44 | v34.92,40.44 34.92,40.01 | v34.92,40.44 34.92,37.78 44.45,28.26 v47.62,28.26 67.63,28.26 | ICSP.2 78.42,28.26 | 78.42,28.26 67.63,28.26 | 3V3.TP 91.76,39.37 | 67.63,28.26 67.63,24.13 C7.1
  Bottom 0.254: ETH1.11 110.06,58.62 109.22,57.78 109.22,55.56 110.06,54.72 v110.06,52.07 ETH1.9 | CASE_TEMP.2 v47.62,28.26
  Bottom 0.508: v73.98,56.83 75.88,54.93 75.88,43.18 v77.15,41.91 | X1.5 23.5,40.44 | 23.5,40.44 v29.84,40.44 v34.92,40.44 | v23.5,33.97 23.5,40.44
+5V  (via drill 0.25)
  Top 0.254: LED4.A 87.53,36.93 88.27,36.2 v88.27,35.56
  Top 0.508: SJ8.2 96.84,35.56 98.42,37.15 D1.C C4.1 101.63,37.23 VR3.1 R2.1 | v79.69,33.02 78.11,31.43 45.72,31.43 v42.23,34.92 | v24.77,34.92 X1.7
  Bottom 0.508: v79.69,33.02 82.23,35.56 v88.27,35.56 89.22,35.56 | 89.22,35.56 SJ8.2 | v42.23,34.92 v24.77,34.92 | 5V.TP 89.22,35.56
  other vias: 92.71,35.56 89.22,41.59
+12V  (via drill 0.35, 0.38)
  Top 0.508: R26.1 VR2.1 101.55,30.41 C27.1
  Top 1.016: C27.1 v92.71,28.26 | K2.2 41.59,57.15 37.47,53.02 37.47,37.47 45.09,29.84 v79.38,29.84 | X1.24 11.87,22.54 8.57,22.54 8.57,2.54 9.53,1.59 v26.35,1.59 v80.96,1.59 | v80.96,1.59 90.81,1.59 91.76,2.54 KA278R12C.3 C26.+ | 12V.TP v80.96,1.59
  Bottom 1.016: K1.2 55.88,54.61 44.13,54.61 K2.2 | v26.35,1.59 26.35,23.18 27.62,24.45 K3.2 | 80.96,28.26 v80.96,1.59 | v92.71,28.26 80.96,28.26 | 80.96,28.26 v79.38,29.84
+24V
  Top 0.254: R40.2 86.68,15.88 87.63,16.83 94.3,16.83 95.25,15.88 95.25,6.99 94.3,6.99
  Top 1.016: 96.84,6.99 KA278R12C.1 | 96.84,6.99 94.3,6.99 KA278R12C.2 | 96.84,6.99 97.47,6.99 98.11,7.62 C25.+ 98.28,9.21 24V.TP
A0_VHF_COAX_REL
  Top 0.254: IC3.36 61.1,8.08 60.64,7.62 R7.1
A1_UHF_COAX_REL
  Top 0.254: IC3.37 61.9,7.61 60.01,5.71 R8.1
A2_PA_FAN
  Top 0.254: IC3.38 62.7,7.14 59.37,3.81 R12.1
A3
  Top 0.254: IC3.39 63.5,7.3 63.82,6.99 A3.TP
A4
  Top 0.254: IC3.40 64.3,7.77 65.41,6.67 66.67,6.67 66.99,6.35 A4.TP
A5
  Top 0.254: IC3.41 65.1,8.24 65.72,7.62 69.85,7.62 70.17,7.3 A5.TP
ACTLED  (via drill 0.25)
  Top 0.254: ETH1.10 111.17,48.3 111.44,48.58 111.44,54.29 110.17,55.56 103.82,55.56 99.38,60.01 v99.38,62.55 | R14.1 95.57,65.72 96.52,64.77 v99.38,64.77
  Bottom 0.254: v99.38,62.55 v99.38,64.77
ADDR
  Top 0.254: ADC1.1 20.91,49.26 20,50.16 20,53.66 20.45,54.1 SJ4.1
  Top 0.508: SJ4.1 SJ3.1 SJ1.1 SJ2.1
AGND
  Top 0.254: IC1.9 84.92,54.61 86.36,54.61 86.36,56.52 87,56.52 | IC1.3 83.96,51.59 83.39,51.03 83.39,50.59 IC1.48 83.39,49.1 | IC1.19 80.39,58.8 81.28,59.69 81.28,62.59 | IC1.16 81.92,57.61 81.92,58.42 82.23,58.74 82.87,58.74 | IC1.14 82.89,58.74 82.87,58.74 | 84.14,59.37 83.5,59.37 82.87,58.74
  Top 0.508: 84.77,49.21 83.39,50.59
  Top 0.813: C19.2 C15.2 C20.2 81.28,62.59 C14.2 84.09,62.59 84.14,62.55 84.14,61.59 | 87,57.78 87,59.37 84.14,59.37 84.14,61.59 | 87,57.78 87,56.52 90.81,56.52 90.81,54.93 | C16.2 87,57.78 | 90.81,54.93 90.81,53.98 | 90.81,53.98 90.81,52.07 | C13.2 90.81,54.93 | C24.2 90.81,53.98 | C21.2 90.81,52.07 | 90.81,52.07 90.81,51.75 89.53,50.48 89.53,49.21 87.95,49.21 | 87.95,49.21 84.77,49.21 | C3.2 87.95,49.21 | FB1.2 84.14,61.59
D7
  Top 0.254: IC3.1 72.9,11.88 73.34,11.43 D7.TP 75.34,5.08 LED1.A
FAN
  Top 1.016: X1.11 14.82,23.81 17.14,23.81 19.05,21.91 21.91,21.91 | K3.5 21.91,21.91 | 21.91,21.91 K3.6
GND  (via drill 0.25)
  Top 0.508: VR2.2 v100.33,31.43
  Top 0.61: v100.33,40.32 VR3.2 | v94.61,33.97 95.25,33.97 | 97.16,33.97 v97.79,33.97
  other vias: 78.11,54.61 78.11,55.88 87.95,62.87 87.95,61.59 87.95,60.33 87,62.87 87,60.33 67.63,51.44 96.2,33.97 104.78,36.51 104.78,37.78 68.9,57.78 68.9,58.74 70.17,42.55 67.63,52.39 67.63,50.48 65.41,53.66 66.36,52.39 97.79,42.55 94.61,42.55 104.78,28.89 63.35,26.67 64.52,26.67 67.31,8.57 56.2,23.18 54.93,23.18 54.61,10.79 54.61,9.53 72.39,9.53 72.39,10.79 75.56,16.51 75.56,15.24 70.8,24.77 70.8,23.5 70.8,15.07 57.15,22.54 65.09,23.18 59.05,8.57 104.78,27.3 23.18,48.26 20.95,52.07 71.44,41.59 19.37,5.08 32.07,16.19 24.45,5.08 29.53,5.08 57.15,21.27 28.89,44.45 27.62,44.45 20.95,53.02 22.54,51.12 25.72,50.48 68.9,49.85 68.9,56.83 68.9,59.69 100.33,32.38 100.33,30.48 96.2,42.55 32.07,17.46 13.02,5.08 32.07,21.27 33.66,19.37 33.34,18.1 33.34,20.64 14.29,5.08 18.1,5.08 23.18,5.08 28.26,5.08 32.07,14.92 61.59,34.61 64.14,34.61 74.93,12.38 76.2,12.38 62.87,34.61 59.05,4.76 59.05,6.67 36.83,4.76 36.83,6.67 36.83,10.79 36.83,12.38 36.83,13.97 35.56,14.61 23.18,49.21 23.18,47.31 63.5,15.88 60.96,15.88 66.04,15.88 66.04,13.34 63.5,13.34 60.96,13.34 60.96,18.41 63.5,18.41 60.96,17.14 60.96,14.61 63.5,14.61 63.5,17.14 66.04,14.61 64.77,13.34 64.77,14.61 64.77,15.88 64.77,17.14 64.77,18.41 62.23,18.41 62.23,17.14 62.23,15.88 62.23,14.61 62.23,13.34 60.96,19.68 62.23,19.68 63.5,19.68 64.77,19.68 60.96,12.06 62.23,12.06 63.5,12.06 64.77,12.06 66.04,12.06 67.31,15.88 67.31,14.61 67.31,13.34 67.31,17.14 66.04,17.14 66.04,18.41 59.69,18.41 59.69,17.14 59.69,15.88 59.69,14.61 59.69,13.34 59.69,12.06 100.33,41.27 100.33,39.37 36.83,8.57 36.83,2.86 23.18,18.1 24.45,18.1 40.96,44.77 40.96,43.5 41.91,42.86 42.86,42.86 53.66,42.86 54.61,42.86 91.76,15.88 90.49,15.24 93.03,15.24 93.03,13.97 93.03,12.7 90.49,12.7 90.49,13.97 98.11,15.24 96.84,14.92 99.38,14.92 96.84,13.65 96.84,12.38 99.38,13.65 87.31,42.23 86.04,42.23 86.04,40.96 87.31,40.96 85.09,29.84 86.68,29.84 83.5,29.84 99.38,12.38 86.68,26.99 86.68,26.04 60.33,8.57 59.05,2.86 86.68,21.91 86.68,22.86 85.72,23.5 85.72,25.4 76.83,49.53 80.64,53.34 81.92,53.34 83.19,53.34 80.64,52.07 81.92,52.07 80.64,50.8 83.19,54.61 81.92,54.61 83.19,55.88 81.92,55.88 80.64,55.88 80.64,54.61 79.38,55.88 78.11,53.34 78.11,52.07 79.38,54.61 79.38,53.34 79.38,52.07 79.38,50.8 81.92,50.8 76.83,57.15 76.83,58.42 76.83,48.26 78.11,50.8 74.78,49.53 66.04,8.57 68.58,8.57
  pour Bottom: 0.32,0.32 0.32,8.57 7.3,8.57 7.3,61.28 0.32,61.28 0.32,69.53 106.36,69.53 106.36,60.64 112.08,60.64 112.08,9.21 106.36,9.21 106.36,0.32
  pour Top: 0.32,0.32 0.32,8.57 7.3,8.57 7.3,61.28 0.32,61.28 0.32,69.53 106.36,69.53 106.36,60.64 112.08,60.64 112.08,9.21 106.36,9.21 106.36,0.32
IRQ
  Top 0.254: 76.31,50.59 IC1.36 75.67,50.59 75.56,50.48 R16.1
LINKLED
  Top 0.254: R15.1 100.01,63.81 100.01,60.33 104.14,56.2 110.24,56.2 ETH1.12
MISO
  Top 0.254: IC1.34 74.77,51.59 73.34,50.16 73.34,48.9 72.39,47.94 72.39,43.81 72.07,43.5 IC2.2
N$1
  Top 0.254: OC3.1 11.11,7.94 12.06,8.89 31.75,8.89 32.38,9.53 R1.2
N$2
  Top 1.016: OC4.4 26.35,18.1 27.62,19.37 K3.9
N$3
  Top 0.61: VR3.3 R2.2
N$4
  Top 0.254: IC3.17 63.5,23.81 63.5,24.13 62.72,24.13 Y1.1
N$5
  Top 0.254: IC3.16 64.3,24.13 65.12,24.13 Y1.3
N$6
  Top 0.254: IC1.31 72.71,53.09 | 72.71,53.09 70.75,53.09 Y2.1 70.85,52.99 C1.1 | R9.1 72.71,53.09
N$7
  Top 0.254: IC1.30 75,53.59 73.66,54.93 73.02,54.93 R9.2 72.39,55.24 71.44,54.29 69.53,54.29 68.97,54.85 Y2.3 67.14,55.47 C2.1
N$8
  Top 0.254: J1.D- 98.81,20.32 R3.1
N$9  (via drill 0.25)
  Top 0.254: R3.2 87.95,20.32 83.19,15.56 v77.47,15.56 | IC3.3 70.34,13.47 70.48,13.34 77.15,13.34 v77.47,13.02
  Bottom 0.254: v77.47,15.56 v77.47,13.02
N$10
  Top 0.254: IC3.4 70.47,14.28 70.48,14.29 83.5,14.29 87.31,18.1 R4.2
N$11
  Top 0.254: R4.1 98.42,18.1 102.55,13.97 104.46,13.97 105.22,14.73 J1.D+
N$12
  Top 0.254: OC1.1 16.19,6.67 17.46,7.94 31.75,7.94 32.07,7.62 R7.2
N$13
  Top 0.254: OC2.1 21.27,6.03 22.23,6.99 31.11,6.99 32.38,5.71 R8.2
N$14
  Top 0.254: IC1.37 77.89,47.73 77.47,47.31 R17.1
N$15
  Top 0.508: OC5.1 56.83,46.67 57.47,46.03 R10.2
N$16
  Top 0.254: LED1.C R29.2
N$17
  Top 0.254: LED2.C 61.49,37.88 R30.2
N$18
  Top 0.254: LED4.C R32.2
N$19
  Top 0.254: LED5.C R33.2
N$20
  Top 0.508: OC6.1 44.77,46.67 45.41,46.03 R11.2
N$21
  Top 0.254: OC4.1 26.35,5.08 27.3,6.03 30.48,6.03 32.7,3.81 R12.2
N$22
  Top 0.508: K1.9 62.87,57.15 63.5,56.52 63.5,46.84 OC5.4
N$23
  Top 0.508: K2.9 51.12,57.15 51.75,56.52 51.75,46.84 OC6.4
N$24
  Top 0.254: LED3.C 64.23,37.88 R31.2
N$25
  Top 0.508: R34.1 63.5,43.97 OC5.3
N$26
  Top 0.508: R35.1 51.75,43.97 OC6.3
N$27
  Top 1.016: OC4.3 R36.1
N$28
  Top 0.254: OC1.3 18.73,11.11 19.05,10.79 30.16,10.79 32.7,13.34 R37.1
N$29
  Top 0.254: IC1.27 75.08,55.09 74.93,55.24 74.93,58.74 73.98,59.69 73.98,63.82 74.61,64.45 89.85,64.45 91.12,65.72 R14.2
N$30
  Top 0.254: IC1.25 75.67,56.09 75.56,56.2 75.56,59.05 74.61,60.01 74.61,63.5 74.93,63.82 R15.2
N$31
  Top 0.508: VR2.5 97.42,30.48 C28.1 C29.1 95.2,30.8 93.34,30.8 92.71,31.43 SJ8.3
N$32
  Top 1.016: OC2.3 R38.1
N$33
  Top 0.254: C20.1 79.89,60.48 IC1.20
N$34
  Top 0.254: IC1.22 78.89,58.31 77.83,59.37 76.2,59.37 C19.1
N$35
  Top 0.254: C23.1 95.89,59.69 ETH1.8
N$36
  Top 0.254: ETH1.7 96.52,56.52 95.25,57.78 C22.1
N$37  (via drill 0.25)
  Top 0.254: R24.1 94.34,55.83 | 94.34,55.83 C24.1 | ETH1.6 v96.2,55.24 95.57,55.88 94.39,55.88 94.34,55.83 | v96.2,61.59 R25.1
  Bottom 0.254: v96.2,55.24 v96.2,61.59
N$38
  Top 0.61: VR2.3 103.22,32.41 R26.2
N$39
  Top 0.508: D1.A 93.09,37.15 SJ8.1 91.38,37.08 90.17,35.88 90.17,24.77 91.44,23.5 F1.2
N$40
  Top 0.254: OC3.3 13.65,10.48 14.29,9.84 31.11,9.84 32.7,11.43 R39.1
N$41
  Top 1.016: R40.1 DIS.1 KA278R12C.5
PA_PWR_REL
  Top 1.016: X1.25 11.91,16.34 11.11,15.56 OC3.4
PMODE0  (via drill 0.25)
  Top 0.254: IC1.45 81.89,48.28 82.23,47.62 v83.19,47.62 R20.1
  Bottom 0.254: v83.19,47.62 83.5,47.31 SJ5.1
PMODE1  (via drill 0.25)
  Top 0.254: IC1.44 81.39,48.05 81.28,47.94 v81.28,47.62 R19.1
  Bottom 0.254: v81.28,47.62 SJ6.1
PMODE2  (via drill 0.25)
  Top 0.254: IC1.43 80.89,48.19 80.33,47.62 v79.38,47.62 R18.1
  Bottom 0.254: SJ7.1 79.06,47.31 v79.38,47.62
RST  (via drill 0.25)
  Top 0.254: IC3.13 66.7,20.66 v67.31,20 | ICSP.5 77.15,21.27 80.01,21.27 83.19,24.45 83.97,24.45 | SW1.4 83.97,24.45 | 83.97,24.45 SW1.2
  Bottom 0.254: ICSP.5 v67.31,20
RX+  (via drill 0.25)
  Top 0.254: R24.2 92.34,55.93 C22.2 88.9,57.78 v88.58,58.1 | IC1.6 85.61,53.09 85.86,53.34 v87,53.34
  Bottom 0.254: v88.58,58.1 88.58,54.93 v87,53.34
RX-  (via drill 0.25)
  Top 0.254: R25.2 92.39,59.74 C23.2 v90.17,59.69 | IC1.5 87.83,52.59 v88.58,53.34
  Bottom 0.254: v88.58,53.34 90.17,54.93 v90.17,59.69
RXLED  (via drill 0.25)
  Top 0.254: IC3.8 70.79,17.48 v70.8,17.46 | RXLED.TP LED3.A
  Bottom 0.254: v70.8,17.46 68.58,17.46 66.36,19.68 RXLED.TP
  other vias: 66.36,33.66
SCL  (via drill 0.25)
  Top 0.254: IC3.18 62.7,23.34 58.74,26.99 44.13,26.99 32.38,38.73 v32.38,42.86 32.38,44.45 33.34,45.4 33.34,47.62 | 26.99,49.53 32.7,49.53 33.34,48.9 33.34,47.62 | SJ1.2 26.99,49.53 | R5.1 33.34,47.62 | 26.99,49.53 26.72,49.26 ADC1.10
  Bottom 0.254: X1.16 17.34,44.58 19.05,42.86 v32.38,42.86
SDA  (via drill 0.25)
  Top 0.254: IC3.19 61.9,23.19 58.42,26.35 43.81,26.35 31.43,38.74 31.43,41.91 | ADC1.9 26.8,48.76 26.99,48.9 v29.21,48.9 32.38,48.9 32.7,48.58 32.7,45.72 R6.1 31.43,41.91 | SJ2.2 v29.21,50.8 | v31.43,41.83 31.43,41.91
  Bottom 0.254: v29.21,50.8 v29.21,48.9 | X1.17 v31.43,41.83
TCT
  Top 0.254: ETH1.3 95.89,51.44 95.25,52.07 C21.1 94.34,50.22 R23.1
TX+  (via drill 0.25)
  Top 0.254: ETH1.1 97.79,46.35 v96.84,46.35 R22.1 | v86.36,51.12 86.33,51.09 IC1.2
  Bottom 0.254: v86.36,51.12 85.41,51.12 85.09,50.8 85.09,49.21 87.95,46.35 v96.84,46.35
TX-  (via drill 0.25)
  Top 0.254: R21.1 v96.84,48.26 97.79,49.21 ETH1.2 | IC1.1 85.71,50.59 86.04,50.26 v86.04,50.16
  Bottom 0.254: v86.04,50.16 87.95,48.26 v96.84,48.26
TXLED  (via drill 0.25)
  Top 0.254: IC3.22 59.5,20.13 v59.37,20 | TXLED.TP LED2.A
  Bottom 0.254: v59.37,20 TXLED.TP
  other vias: 59.37,33.66
UHF_COAX_REL
  Top 1.016: OC2.4 21.27,15.88 16.02,21.13 X1.12
UHF_PTT_COM
  Top 1.016: K2.5 46.67,49.53 | 46.67,49.53 K2.6 | UHF_PTT.2 46.67,49.53
UHF_PTT_NC
  Top 1.016: K2.10 UHF_PTT.3
UHF_PTT_NO
  Top 1.016: K2.1 UHF_PTT.1
V_CASE  (via drill 0.25)
  Top 0.254: ADC1.7 v24.45,47.76 | v39.05,47.31 39.05,37.78 40.32,36.51 CASE_TEMP.3
  Bottom 0.254: v24.45,47.76 38.6,47.76 v39.05,47.31
V_FWD
  Top 0.254: X1.2 18.91,48.72 19.87,47.76 ADC1.4
V_REV
  Top 0.254: ADC1.5 19.95,47.26 18.67,45.97 X1.3
V_TEMP
  Top 0.254: ADC1.6 25.04,47.26 24.13,46.35 20.32,46.35 17.14,43.18 14.78,43.18 X1.4
VBUS
  Top 0.254: IC3.7 71.28,16.68 72.39,17.78 83.82,17.78 87.95,21.91 97.16,21.91 97.62,22.38 F1.1
  Top 1.016: J1.VBUS 103.24,22.49 102.23,23.5 F1.1
VDDA  (via drill 0.25)
  Top 0.254: 82.39,56.52 83.82,56.52 | 83.82,56.52 83.82,55.59 | 83.82,55.59 83.82,54.09 | 83.82,54.09 83.82,52.07 | 83.82,52.07 v83.19,52.07 | 81.39,56.52 IC1.17 81.39,58.53 82.55,59.69 C14.1 | 81.39,56.52 82.39,56.52 | IC1.15 82.39,56.52 | IC1.11 83.82,55.59 | 83.82,54.09 IC1.8 87.15,54.09 C13.1 | 83.82,52.07 84.89,52.07 IC1.4 87.95,52.09 | C15.1 78.11,59.69 79.38,58.42 79.38,57.61 IC1.21 79.39,56.53 79.42,56.52 81.39,56.52 | 83.82,56.52 84.72,57.42 C16.1 | v90.81,49.53 91.44,50.16 R23.2 R21.2 R22.2 | v89.53,52.39 89.2,52.09 87.95,52.09 | 87.95,52.09 C3.1 | FB2.2 85.09,47.31 v84.45,47.94
  Bottom 0.254: v90.81,49.53 89.53,50.8 v89.53,52.39 | v84.45,47.94 83.19,49.21 v83.19,52.07
VHF_COAX_REL
  Top 1.016: X1.13 16.19,16.93 OC1.4
VHF_PTT_COM
  Top 1.016: K1.5 58.42,49.53 | 58.42,49.53 K1.6 | VHF_PTT.2 58.42,49.53
VHF_PTT_NC
  Top 1.016: K1.1 VHF_PTT.1
VHF_PTT_NO
  Top 1.016: K1.10 VHF_PTT.3

### Text on the board
tPlace: DESIGNED BY KJ4QLP, 20180108 | PN: VHF/UHF PA Control, Rev. - | PROJECT: VTGS | SN: | ADS1115 ADDR | GND | +3V3 | SCL | SDA | GND | 3V3 | 5V | VUSB | 5V | V_CASE | +3V3 | GND | VREG | RESET | MISO | +3V3 | SCK | MOSI | RST | GND | DB-25-M PINOUT | 1 - PA_PWR_GND / 2 - PA_PWR_VFWD / 3 - PA_PWR_VREV / 4 - PA_TEMP_VTEMP / 5 - PA_TEMP_+3V3 / 6 - PA_TEMP_GND / 7 - LCD_+5V / 8 - LCD_RXD / 9 - BUTTON_BLACK / 10 - THERMO_B / 11 - FAN_GND / 12 - COAX_REL_UHF / 13 - COAX_REL_VHF | PA_IMON_GND - 14 / PA_IMON_+3V3 - 15 / PA_IMON_SCL - 16 / PA_IMON_SDA - 17 / PA_IMON_ALERT_I - 18 / PA_IMON_ALERT_T - 19 / LCD_GND - 20 / BUTTON_RED - 21 / BUTTON_GND - 22 / THERMO_A_GND - 23 / PA_PWR_REL_+12V - 24 / PA_PWR_REL_GND - 25 | GND | DIS | GND | +12V | +24V | +24V
bPlace: 0 0 0 = 10BT Half-duplex, Auto-negotiation disabled / 0 0 1 = 10BT Full-duplex, Auto-negotiation disabled / 0 1 0 = 100BT Half-duplex, Auto-negotiation disabled / 0 1 1 = 100BT Full-duplex, Auto-negotiation disabled / 1 0 0 = 100BT Half-duplex, Auto-negotiation enabled / 1 1 1 = All capable, Auto-negotiation enabled (DEFAULT) | PM2 | PM1 | PM0
tNames: NO | COM | NC | NO | COM | NC